# EAGLE design shoes (EAGLE 6.5.0)
AUTHOR: Brad Campbell; REV: A; TITLE: Shoes!
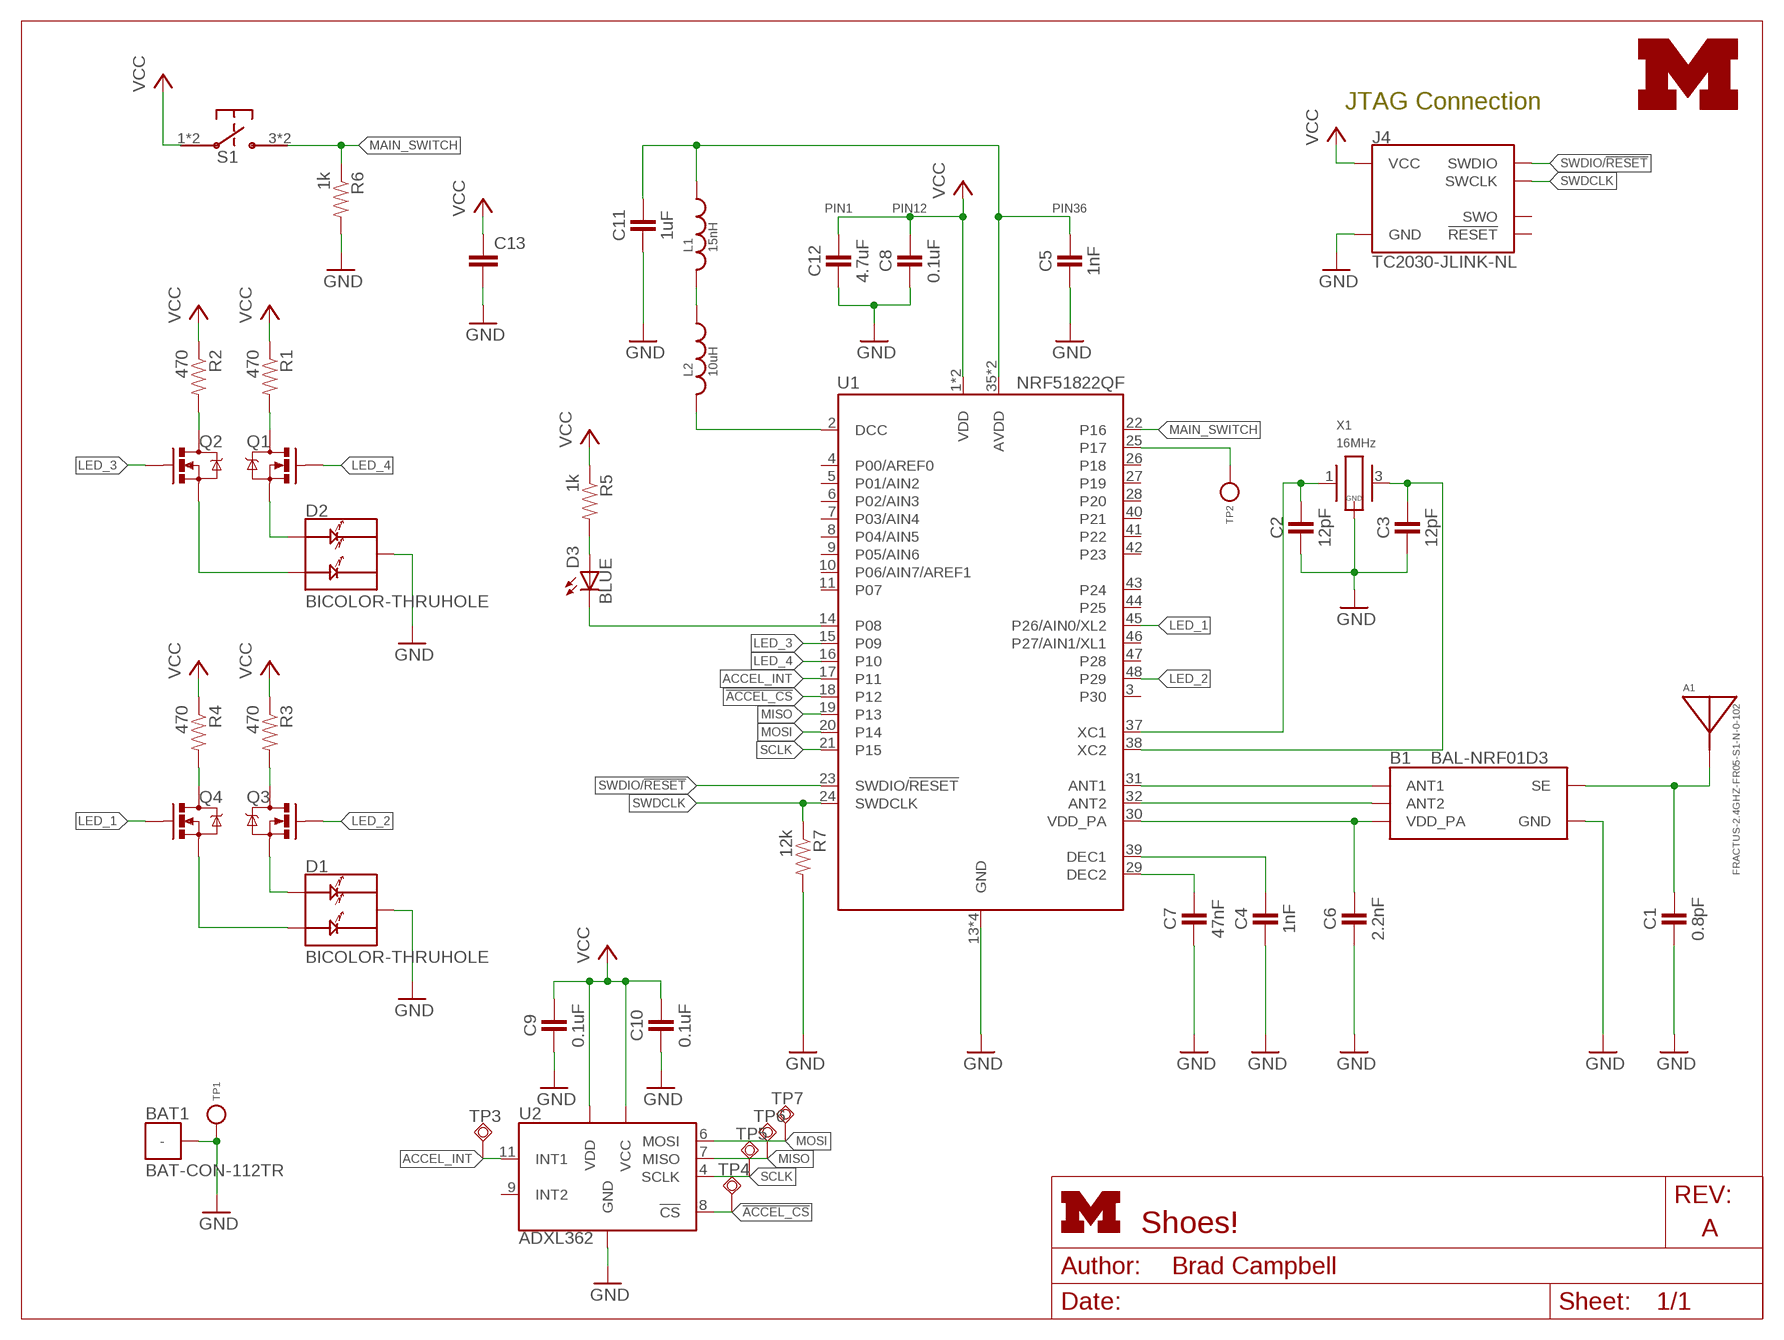
[diagram p0: schematic, sheet 1]
FRAME1 (LETTER_L): HEIGHT: 8.5in; WIDTH: 11in

## Parts
A1  FRACTUS-2.4GHZ-FR05-S1-N-0-102  [FRACTUS-ANTENNA-FR05-S1-N-0-102]
B1  BAL-NRF01D3  [BAL-NRF01D3]
BAT1  BAT-CON-112TR  [BAT-CON-112TR]
C1  0.8pF  CAPACITOR  [0402_CAP]
C2  12pF  CAPACITOR  [0402_CAP]
C3  12pF  CAPACITOR  [0402_CAP]
C4  1nF  CAPACITOR  [0402_CAP]
C5  1nF  CAPACITOR  [0402_CAP]
C6  2.2nF  CAPACITOR  [0402_CAP]
C7  47nF  CAPACITOR  [0402_CAP]
C8  0.1uF  CAPACITOR  [0402_CAP]
C9  0.1uF  CAPACITOR  [0402_CAP]
C10  0.1uF  CAPACITOR  [0402_CAP]
C11  1uF  CAPACITOR  [0402_CAP]
C12  4.7uF  CAPACITOR  [0402_CAP]
C13  CAP0805  [0805]
D1  BICOLOR-THRUHOLE  [3AXIS-0.1IN]
D2  BICOLOR-THRUHOLE  [3AXIS-0.1IN]
D3  BLUE  LED0603  [LED-0603]
J4  TC2030-JLINK-NL  [TC2030-IDC-NL]
L1  15nH  INDUCTOR0402  [0402_CAP]
L2  10uH  INDUCTOR0603  [0603_CAP]
LOGO3  UMICH_SOLID_TINY  [UMICH_SOLID_50MIL]
Q1  MOSFET-NCHANNELXFDN-3  [XFDFN-3]
Q2  MOSFET-NCHANNELXFDN-3  [XFDFN-3]
Q3  MOSFET-NCHANNELXFDN-3  [XFDFN-3]
Q4  MOSFET-NCHANNELXFDN-3  [XFDFN-3]
R1  470  RESISTOR  [0402_RES]
R2  470  RESISTOR  [0402_RES]
R3  470  RESISTOR  [0402_RES]
R4  470  RESISTOR  [0402_RES]
R5  1k  RESISTOR  [0402_RES]
R6  1k  RESISTOR  [0402_RES]
R7  12k  RESISTOR  [0402_RES]
S1  TL3315NF100Q  [TL3315NF100Q]
TP1  TEST_POINT_0.020IN  [TESTPOINT_0.020IN]
TP2  TEST_POINT_0.020IN  [TESTPOINT_0.020IN]
TP3  TPSQTP06SQ  [TP06SQ]
TP4  TPSQTP06SQ  [TP06SQ]
TP5  TPSQTP06SQ  [TP06SQ]
TP6  TPSQTP06SQ  [TP06SQ]
TP7  TPSQTP06SQ  [TP06SQ]
U1  NRF51822QF  [QFN-48-6MM]
U2  ADXL362  [TFLGA-16/3.3MMX3.1MM]
X1  16MHz  TXC-8Y  [TXC-8Y]

## Nets
!ACCEL_CS: TP4.TP U1.18(P12) U2.8(!CS)
ACCEL_INT: TP3.TP U1.17(P11) U2.11(INT1)
AVDD: C5.1 C11.1 L1.1 U1.35(AVDD) U1.36(AVDD)
DCC: L2.2 U1.2(DCC)
GND: B1.GND BAT1.PAD(-) C1.2 C2.2 C3.2 C4.2 C5.2 C6.2 C7.2 C8.2 C9.2 C10.2 C11.2 C12.2 C13.2 D1.M(C) D2.M(C) J4.5(GND) R6.2 R7.2 TP1.TESTPOINT U1.13(GND) U1.33(GND) U1.34(GND) U1.GND U2.12(GND) U2.13(GND) U2.16(GND) X1.2(GND) X1.4(GND)
LED_1: Q4.G U1.45(P26/AIN0/XL2)
LED_2: Q3.G U1.48(P29)
LED_3: Q2.G U1.15(P09)
LED_4: Q1.G U1.16(P10)
MAIN_SWITCH: R6.1 S1.3 S1.4 U1.22(P16)
MISO: TP6.TP U1.19(P13) U2.7(MISO)
MOSI: TP7.TP U1.20(P14) U2.6(MOSI)
N$1: TP2.TESTPOINT U1.25(P17)
N$4: D2.1(A1) Q1.S
N$5: B1.ANT1 U1.31(ANT1)
N$6: B1.ANT2 U1.32(ANT2)
N$7: D3.C U1.14(P08)
N$8: D2.2(A2) Q2.S
N$9: Q2.D R2.2
N$10: Q1.D R1.2
N$11: A1.1(ANTENNA) B1.SE C1.1
N$12: D1.1(A1) Q3.S
N$13: D1.2(A2) Q4.S
N$14: L1.2 L2.1
N$15: Q4.D R4.2
N$16: C2.1 U1.37(XC1) X1.1
N$17: C3.1 U1.38(XC2) X1.3
N$18: C4.1 U1.39(DEC1)
N$19: C7.1 U1.29(DEC2)
N$20: Q3.D R3.2
N$23: D3.A R5.2
SCLK: TP5.TP U1.21(P15) U2.4(SCLK)
SWDCLK: J4.4(SWCLK) R7.1 U1.24(SWDCLK)
SWDIO/!RESET: J4.2(SWDIO) U1.23(SWDIO/!RESET)
VCC: C8.1 C9.1 C10.1 C12.1 C13.1 J4.1(VCC) R1.1 R2.1 R3.1 R4.1 R5.1 S1.1 S1.2 U1.1(VDD) U1.12(VDD) U2.1(VDD) U2.14(VCC)
VDD_PA: B1.VCC(VDD_PA) C6.1 U1.30(VDD_PA)
Unconnected: J4.3(!RESET) J4.6(SWO) U1.3(P30) U1.4(P00/AREF0) U1.5(P01/AIN2) U1.6(P02/AIN3) U1.7(P03/AIN4) U1.8(P04/AIN5) U1.9(P05/AIN6) U1.10(P06/AIN7/AREF1) U1.11(P07) U1.26(P18) U1.27(P19) U1.28(P20) U1.40(P21) U1.41(P22) U1.42(P23) U1.43(P24) U1.44(P25) U1.46(P27/AIN1/XL1) U1.47(P28) U2.9(INT2)

## Notes on the sheet
- JTAG Connection
- PIN1 | PIN12 | PIN36

## Library data of the parts
A1 = chips:FRACTUS-2.4GHZ-FR05-S1-N-0-102: Fractus Compact Reach XtendTM chip antenna is engineered specifically for Bluetooth, WLAN 802.11 b/g/n and other wireless devices operating at the ISM 2.4 GHz band. Compact Reach Xtend combines small form factor size and high performance to improve the functionality of your wireless devices.; RICHARDSON_RFPD: FR05-S1-N-0102B
B1 = chips:BAL-NRF01D3: 50 ohm nominal input / conjugate match balun to nRF51422-QFAA, nRF24LE1, nRF51822-QFAA/AB, with integrated harmonic filter; DIGIKEY: 497-13637-1-ND; MOUSER: 511-BAL-NRF01D3
BAT1 = batteries:BAT-CON-112TR; DIGIKEY: 36-112CT-ND
C1 = passives:CAPACITOR: 0402 Capacitor; DIGIKEY: 490-6269-1-ND
C2 C3 = passives:CAPACITOR: 0402 Capacitor; DIGIKEY: 490-6197-1-ND
C4 C5 = passives:CAPACITOR: 0402 Capacitor; DIGIKEY: 490-1303-1-ND
C6 = passives:CAPACITOR: 0402 Capacitor; DIGIKEY: 490-5419-1-ND
C7 = passives:CAPACITOR: 0402 Capacitor; DIGIKEY: 445-1264-1-ND
C8-C10 = passives:CAPACITOR: 0402 Capacitor; DIGIKEY: 445-4952-1-ND
C11 = passives:CAPACITOR: 0402 Capacitor; DIGIKEY: 1276-1513-1-ND
C12 = passives:CAPACITOR: 0402 Capacitor; DIGIKEY: 445-5947-1-ND
C13 = SparkFun-Capacitors:CAP: Capacitor Standard 0603 ceramic capacitor, and 0.1" leaded capacitor.
D1 D2 = leds:BICOLOR-THRUHOLE: 3 axis thru-hold LED
D3 = SparkFun-LED:LED: LEDs Standard schematic elements and footprints for 5mm, 3mm, 1206, and 0603 sized LEDs. 5mm - Spark Fun Electronics SKU : COM-00529 (and others)
J4 = connector:TC2030-JLINK
L1 = passives:INDUCTOR; DIGIKEY: 587-1521-1-ND
L2 = passives:INDUCTOR; DIGIKEY: 490-4025-1-ND
LOGO3 = logos:UMICH_SOLID
Q1-Q4 = fets:MOSFET-NCHANNEL: Generic NMOS footprint; DIGIKEY: DMN2400UFB4-7DICT-ND
R1-R4 = passives:RESISTOR: Resistor Basic schematic elements and footprints for 0603, 1206, and PTH resistors.; DIGIKEY: RHM470CDCT-ND
R5 R6 = passives:RESISTOR: Resistor Basic schematic elements and footprints for 0603, 1206, and PTH resistors.; DIGIKEY: RHM1.0KCECT-ND
R7 = passives:RESISTOR: Resistor Basic schematic elements and footprints for 0603, 1206, and PTH resistors.; DIGIKEY: RHM12.0KCDCT-ND
S1 = switches:TL3315NF100Q: SWITCH TACTILE SPST-NO 0.05A 15V; DIGIKEY: EG4620CT-ND
TP1 TP2 = headers:TEST_POINT_0.020IN
TP3-TP7 = testpad:TPSQ: Test pad
U1 = chips:NRF51822: Multiprotocol Bluetooth® 4.0 low energy/2.4 GHz RF SoC; DIGIKEY: 1490-1032-1-ND; MOUSER: 949-NRF51822-QFAB-R7
U2 = chips:ADXL362: IC ACCEL DIG LO PWR 3AX 16LGA; DIGIKEY: ADXL362BCCZ-RL7CT-ND; MOUSER: 584-ADXL362BCCZ-R7; NEWARK: 47W0478
X1 = crystals:TXC-8Y: 2mmx1.6mm SMD Crystal; DIGIKEY: 887-2003-1-ND

## Board
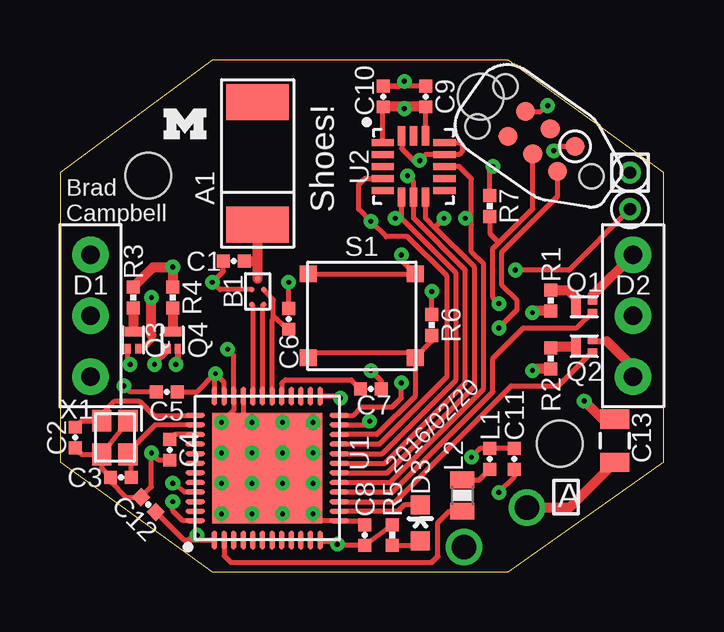
[diagram p1: board, top side]
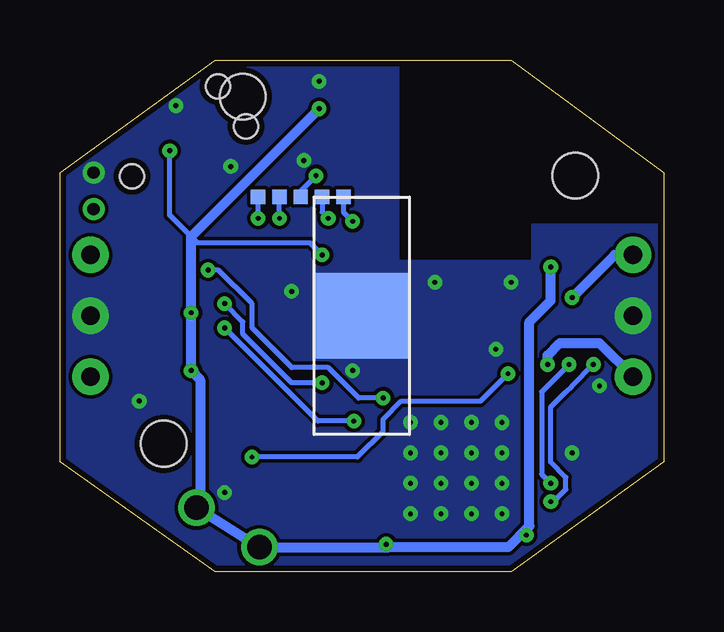
[diagram p2: board, bottom side, seen from below]

Size 25.15 x 21.34 mm. Coordinates in mm from the lower left corner, seen from the top.
Outline: 0,4.57 6.35,0 18.67,0 25.15,4.57 25.15,16.64 18.67,21.34 6.35,21.34 0,16.64 0,4.57
Copper layers (1*16): Top 0.0178mm / dielectric 59mil / Bottom 0.0178mm
Design rules "sunstone-2lyr_v1.0.0.3 *": minimum track width 6mil, minimum drill 8mil, track to track 6mil, track to pad 6mil, pad to pad 6mil, via to via 6mil, smd to smd 6mil, copper to edge 10mil, drill to drill 16mil, minimum pad ring 8mil, minimum via ring 8mil, stop-mask expansion 3mil, vias tented up to drill 50mil, thermal gap 10mil
Holes 1.91 mm at 3.68,16.51 17.53,19.81 20.83,5.33

### Footprints (pad centres in the part's own frame; a part is rotated, then mirrored left to right if it is on the bottom)
FRACTUS-ANTENNA-FR05-S1-N-0-102 = smd 1.5 x 2.6: 1 -2.55,0; 2 2.55,0
BAL-NRF01D3 = smd 0.22 x 0.22: ANT1 -0.537,-0.25; ANT2 -0.537,0.25; GND 0.069,0.25; SE 0.537,0; VCC 0.069,-0.25
BAT-CON-112TR = smd 3.962 x 3.556: PAD 0,0
0402_CAP = smd 0.536 x 0.546: 1 -0.433,0; 2 0.433,0
0805 = smd 0.8 x 1.2: 1 -0.9,0; 2 0.9,0
3AXIS-0.1IN = drill 0.762 pad 1.524: 1 -2.54,0; 2 2.54,0; M 0,0
LED-0603 = smd 0.8 x 0.8: A 0,-0.75; C 0,0.75
TC2030-IDC-NL = smd 0.787 x 0.787: 1 -1.27,-0.635; 2 -1.27,0.635; 3 0,-0.635; 4 0,0.635; 5 1.27,-0.635; 6 1.27,0.635 | hole 1.016: -2.54,0; 2.54,1.016; 2.54,-1.016
0603_CAP = smd 0.7 x 1: 1 -0.65,0; 2 0.65,0
XFDFN-3 = smd 0.4 x 0.7: D 0.35,0 | smd 0.4 x 0.25: G -0.35,0.215; S -0.35,-0.215
0402_RES = smd 0.536 x 0.546: 1 -0.433,0; 2 0.433,0
TL3315NF100Q = smd 0.7 x 0.7: 1 -2.225,1.75; 2 2.225,1.75; 3 -2.225,-1.75; 4 2.225,-1.75
TESTPOINT_0.020IN = drill 0.508: TESTPOINT 0,0
TP06SQ = smd 0.6 x 0.6: TP 0,0
QFN-48-6MM = smd 0.8 x 0.203: 1 -3,2.2; 2 -3,1.8; 3 -3,1.4; 4 -3,1; 5 -3,0.6; 6 -3,0.2; 7 -3,-0.2; 8 -3,-0.6; 9 -3,-1; 10 -3,-1.4; 11 -3,-1.8; 12 -3,-2.2; 25 3,-2.2; 26 3,-1.8; 27 3,-1.4; 28 3,-1; 29 3,-0.6; 30 3,-0.2; 31 3,0.2; 32 3,0.6; 33 3,1; 34 3,1.4; 35 3,1.8; 36 3,2.2 | smd 0.203 x 0.8: 13 -2.2,-3; 14 -1.8,-3; 15 -1.4,-3; 16 -1,-3; 17 -0.6,-3; 18 -0.2,-3; 19 0.2,-3; 20 0.6,-3; 21 1,-3; 22 1.4,-3; 23 1.8,-3; 24 2.2,-3; 37 2.2,3; 38 1.8,3; 39 1.4,3; 40 1,3; 41 0.6,3; 42 0.2,3; 43 -0.2,3; 44 -0.6,3; 45 -1,3; 46 -1.4,3; 47 -1.8,3; 48 -2.2,3 | smd 4.6 x 4.6: GND 0,0
TFLGA-16/3.3MMX3.1MM = smd 0.925 x 0.3: 1 -1.288,1; 2 -1.288,0.5; 3 -1.288,0; 4 -1.288,-0.5; 5 -1.288,-1; 9 1.288,-1; 10 1.288,-0.5; 11 1.288,0; 12 1.288,0.5; 13 1.288,1 | smd 0.3 x 0.8: 6 -0.5,-1.275; 7 0,-1.275; 8 0.5,-1.275; 14 0.5,1.275; 15 0,1.275; 16 -0.5,1.275
TXC-8Y = smd 0.9 x 0.8: 1 -0.7,-0.55; 2 0.7,-0.55; 3 0.7,0.55; 4 -0.7,0.55

### Placement (x,y rotation side)
A1  8.23,17.02 90 top
B1  8.23,11.68 90 top
BAT1  12.57,10.67 0 bottom
C1  7.24,12.95 180 top
C2  0.63,5.59 270 top
C3  2.54,3.94 180 top
C4  4.57,5.08 270 top
C5  4.45,7.49 180 top
C6  9.53,10.54 90 top
C7  12.95,7.62 0 top
C8  12.7,1.52 90 top
C9  15.24,19.81 90 top
C10  13.46,19.81 90 top
C11  18.92,4.7 270 top
C12  3.68,2.79 135 top
C13  23.11,5.46 90 top
D1  1.27,10.67 270 top
D2  23.88,10.67 270 top
D3  15.01,2.03 0 top
J4  20.06,17.94 145 top
L1  17.91,4.7 270 top
L2  16.76,3.17 270 top
LOGO3  5.21,18.67 0 top
Q1  21.84,11.05 180 top
Q2  21.84,9.4 180 top
Q3  3.05,9.65 90 top
Q4  4.7,9.65 90 top
R1  20.45,11.3 90 top
R2  20.45,8.89 90 top
R3  3.05,11.43 270 top
R4  4.7,11.43 270 top
R5  13.84,1.52 270 top
R6  15.49,10.29 90 top
R7  17.91,15.24 90 top
S1  12.57,10.67 0 top
TP1  23.75,16.64 0 top
TP2  23.75,15.11 0 top
TP3  16.89,15.62 0 bottom
TP4  16,15.62 0 bottom
TP5  13.34,15.62 0 bottom
TP6  15.11,15.62 0 bottom
TP7  14.22,15.62 0 bottom
U1  8.64,4.32 90 top
U2  14.73,16.89 0 top
X1  2.29,5.59 270 top

### Tracks (layer width: path | path; a pad name or v marks a point on that pad's centre or on a via)
!ACCEL_CS  (via drill 0.2)
  Top 0.203: U1.18 13.64,4.12 17.27,7.75 17.27,12.7 15.62,14.35 | 15.23,15.5 U2.8 15.23,14.74 15.62,14.35 | 15.62,14.35 v16,14.73
  Bottom 0.203: v16,14.73 TP4.TP
ACCEL_INT  (via drill 0.2)
  Top 0.203: U1.17 13.75,3.72 17.65,7.62 17.65,12.83 17.14,13.33 17.14,14.48 | 17.14,14.48 17.14,16.38 16.64,16.89 U2.11 | v16.89,14.73 17.14,14.48
  Bottom 0.203: v16.89,14.73 TP3.TP
AVDD  (via drill 0.2)
  Top 0.203: C11.1 L1.1 17.5,5.13 v17.14,4.77 | 6.44,7.41 U1.36 | U1.35 6.84,7.9 v6.48,8.25 | 6.44,7.71 U1.36 | C5.1 5.72,7.49 v6.48,8.25 | v6.48,8.25 6.44,8.21 U1.36
  Bottom 0.203: v6.48,8.25 7.62,7.11 10.92,7.11 11.68,6.35 11.68,5.84 12.75,4.77 v17.14,4.77
DCC
  Top 0.203: U1.2 6.84,0.66 7.11,0.38 15.49,0.38 15.75,0.63 15.75,2.03 16.24,2.52 L2.2
GND  (via drill 0.2)
  Top 0.203: C2.2 0.9,4.89 X1.2 | X1.2 1.74,4.31 C3.2 2.11,3.73 2.74,3.1 C12.2 3.81,3.53 v3.81,4.95 4.12,4.65 C4.2 | X1.2 X1.4 | v10.54,2.41 10.84,2.12 U1.13 12.54,2.12 C8.2 | v6.73,6.22 7.24,6.73 U1.34 7.24,9.02 v6.99,9.27 | U1.33 7.64,6.59 v8,6.22 | U1.GND v9.27,4.95 | C5.2 2.92,7.49 v2.67,7.75 | J4.5 20.01,19.18 v20.32,19.43 | U2.16 14.23,17.64 14.73,17.14 v14.99,17.14 15.23,17.39 U2.12 16.63,17.39 16.76,17.53 16.76,17.78 16.65,17.89 U2.13 | C9.2 C10.2 14.15,20.24 v14.35,20.45 | C11.2 18.92,3.94 v18.29,3.3 | C7.2 13.39,7.95 v12.95,8.38 | R7.2 17.91,16.76 v18.03,16.89 | R6.2 v15.49,11.68 | C1.2 6.81,12.52 v6.35,12.06 6.66,11.75 B1.GND | C6.2 v9.53,12.06
  Top 0.406: 23.12,6.35 C13.2 22.59,6.36 v21.84,7.11
  other vias: 9.27,3.68 8,3.68 6.73,3.68 6.73,2.41 8,2.41 9.27,2.41 10.54,3.68 6.73,4.95 8,4.95 10.54,4.95 9.27,6.22 10.54,6.22
  pour Bottom (no thermals): 0,14.48 5.46,14.48 5.46,12.95 11.05,12.95 11.05,21.34 18.67,21.34 25.15,16.64 25.15,4.57 18.67,0 6.35,0 0,4.57
LED_1  (via drill 0.2)
  Top 0.203: U1.45 5.19,3.32 v4.7,3.68 | Q4.G 4.48,9.18 v3.94,8.64
  Bottom 0.203: v3.94,8.64 5.08,7.49 5.08,4.06 v4.7,3.68
LED_2  (via drill 0.2)
  Top 0.203: U1.48 5.12,2.12 4.7,2.54 v4.7,2.92 | v2.92,8.64 2.83,8.72 Q3.G
  Bottom 0.203: v2.92,8.64 3.81,7.75 4.06,7.49 4.7,6.86 4.7,4.57 4.06,3.94 4.06,3.43 4.57,2.92 v4.7,2.92
LED_3
  Top 0.203: U1.15 13.97,2.92 18.8,7.75 20.76,7.75 Q2.G
LED_4
  Top 0.203: Q1.G 21.52,10.16 19.3,10.16 18.03,8.89 18.03,7.49 13.86,3.32 U1.16
MAIN_SWITCH
  Top 0.203: S1.4 14.8,7.3 13.21,5.71 U1.22 | S1.3 10.57,9.14 14.57,9.14 S1.4 | S1.4 15.49,9.61 R6.1
MISO  (via drill 0.2)
  Top 0.203: U1.19 13.54,4.52 16.89,7.87 16.89,12.57 14.73,14.73 U2.7 14.73,16.26 v14.48,16.51
  Bottom 0.203: v14.48,16.51 15.11,15.88 TP6.TP
MOSI  (via drill 0.2)
  Top 0.203: U1.20 13.43,4.92 16.51,8 16.51,12.45 14.23,14.72 | 14.23,14.72 U2.6 | 14.23,14.72 v13.98,14.72 v13.97,14.73
  Bottom 0.203: TP7.TP 14.22,14.99 v13.97,14.73
N$1  (via drill 0.2)
  Top 0.203: U1.25 11.61,7.32 v11.68,7.24 | TP2.TESTPOINT 21.21,12.57 v18.97,12.57
  Bottom 0.203: v11.68,7.24 12.7,7.24 13.97,8.51 15.49,8.51 17.14,10.16 17.14,11.18 18.54,12.57 v18.97,12.57
N$4
  Top 0.254: Q1.S 22.19,11.53
  Top 0.406: 22.19,11.53 D2.1
N$5
  Top 0.203: B1.ANT1 8.44,11.1 U1.31
N$6
  Top 0.203: B1.ANT2 8.04,11.09 U1.32
N$7
  Top 0.203: D3.C 14.34,2.78 14.08,2.52 U1.14
N$8
  Top 0.254: Q2.S 22.77,9.61
  Top 0.406: 22.77,9.61 23.88,8.51 D2.2
N$9
  Top 0.406: R2.2 20.52,9.4 Q2.D
N$10
  Top 0.406: R1.2 21.16,11.74 21.49,11.4 Q1.D
N$11
  Top 0.406: B1.SE 8.23,12.95 | 8.23,12.95 A1.1 | C1.1 8.23,12.95
N$12  (via drill 0.2)
  Top 0.254: Q3.S 3.46,9.3 3.81,9.65 3.81,9.85
  Top 0.406: 3.81,9.85 v3.81,11.43
  Bottom 0.406: v3.81,11.43 2.03,13.21 D1.1
N$13  (via drill 0.2)
  Top 0.254: Q4.S 4.91,8.72
  Top 0.406: 4.91,8.72 v4.83,8.64
  Bottom 0.406: v4.83,8.64 4.83,9.02 4.32,9.52 2.67,9.52 D1.2
N$14
  Top 0.203: L2.1 17.47,3.82 L1.2
N$15
  Top 0.406: R4.2 Q4.D
N$16
  Top 0.203: C2.1 0.9,6.29 X1.1 1.74,6.56 2.29,7.11 3.3,7.11 3.9,6.52 U1.37
N$17
  Top 0.203: C3.1 2.97,4.75 X1.3 2.84,4.99 3.96,6.12 U1.38
N$18
  Top 0.203: U1.39 4.78,5.72 C4.1
N$19
  Top 0.203: U1.29 9.24,7.84 9.4,8 12.14,8 C7.1
N$20
  Top 0.406: R3.2 Q3.D
N$23
  Top 0.203: R5.2 14.82,1.09 D3.A
SCLK  (via drill 0.2)
  Top 0.203: U1.21 13.32,5.32 16.13,8.13 16.13,12.32 14.48,13.97 13.59,13.97 v12.95,14.6 12.45,15.11 12.45,16.13 12.71,16.39 U2.4
  Bottom 0.203: TP5.TP 13.34,14.99 v12.95,14.6
SWDCLK  (via drill 0.2)
  Top 0.203: U1.24 12.23,6.52 12.57,6.86 13.84,6.86 14.22,7.24 v14.22,7.87 | R7.1 17.91,14.1 18.29,13.72 | v18.29,11.18 18.03,11.43 18.03,13.47 18.29,13.72 | 18.29,13.72 19.7,15.13 J4.4
  Bottom 0.203: v14.22,7.87 15.49,7.87 17.53,9.91 17.53,10.41 v18.29,11.18
SWDIO/!RESET  (via drill 0.2)
  Top 0.203: U1.23 12.75,6.12 v12.9,6.27 | v18.29,10.16 19.05,10.92 19.05,11.3 18.41,11.94 18.41,13.33 20.74,15.66 J4.2
  Bottom 0.203: v12.9,6.27 14.4,6.27 v18.29,10.16
VCC  (via drill 0.2, 1.02)
  Top 0.203: U1.12 10.88,1.27 11.43,1.27 v11.56,1.14 11.61,1.09 C8.1 R5.1 | 5.33,1.32 5.16,1.32 C12.1 | 5.33,1.32 U1.1 | v5.72,1.52 5.54,1.52 5.33,1.32 | U2.14 15.23,19.37 C9.1 | U2.1 13.45,19.36 C10.1 | S1.1 S1.2 14.22,12.99 v14.22,13.21 | v20.57,17.55 20.76,17.73 J4.1
  Top 0.406: R4.1 v4.7,12.7 3.88,12.7 R3.1 | R2.1 19.76,8.46 v19.69,8.38 | R1.1 19.76,10.87 v19.69,10.79 | C10.1 14.28,19.38 v14.35,19.3 14.43,19.38 C9.1 | C13.1 21.22,2.67 v19.46,2.67
  Bottom 0.203: 5.59,1.9 5.59,1.65 v5.72,1.52 | v20.57,17.55 20.57,14.86 19.69,13.97 19.43,13.72 14.73,13.72 v14.22,13.21
  Bottom 0.406: v4.7,12.7 4.7,11.3 5.59,10.41 5.59,1.9 6.48,1.02 11.43,1.02 | 11.43,1.02 v11.56,1.14 11.68,1.02 | 11.68,1.02 v16.84,1.02 v19.46,2.67 19.3,2.82 19.3,8 v19.69,8.38 v19.69,10.79 19.69,13.97 v14.35,19.3 | 11.68,1.02 11.43,1.02
VDD_PA
  Top 0.203: C6.1 9.4,10.11 9.4,10.16 8.89,10.67 | U1.30 8.84,10.49 8.89,10.54 8.89,10.67 | 8.89,10.67 8.89,11.34 B1.VCC

### Text on the board
tPlace: Brad / Campbell | Shoes! | 2016/02/20 | A